# EAGLE design ttl_box (EAGLE 8.3.1)
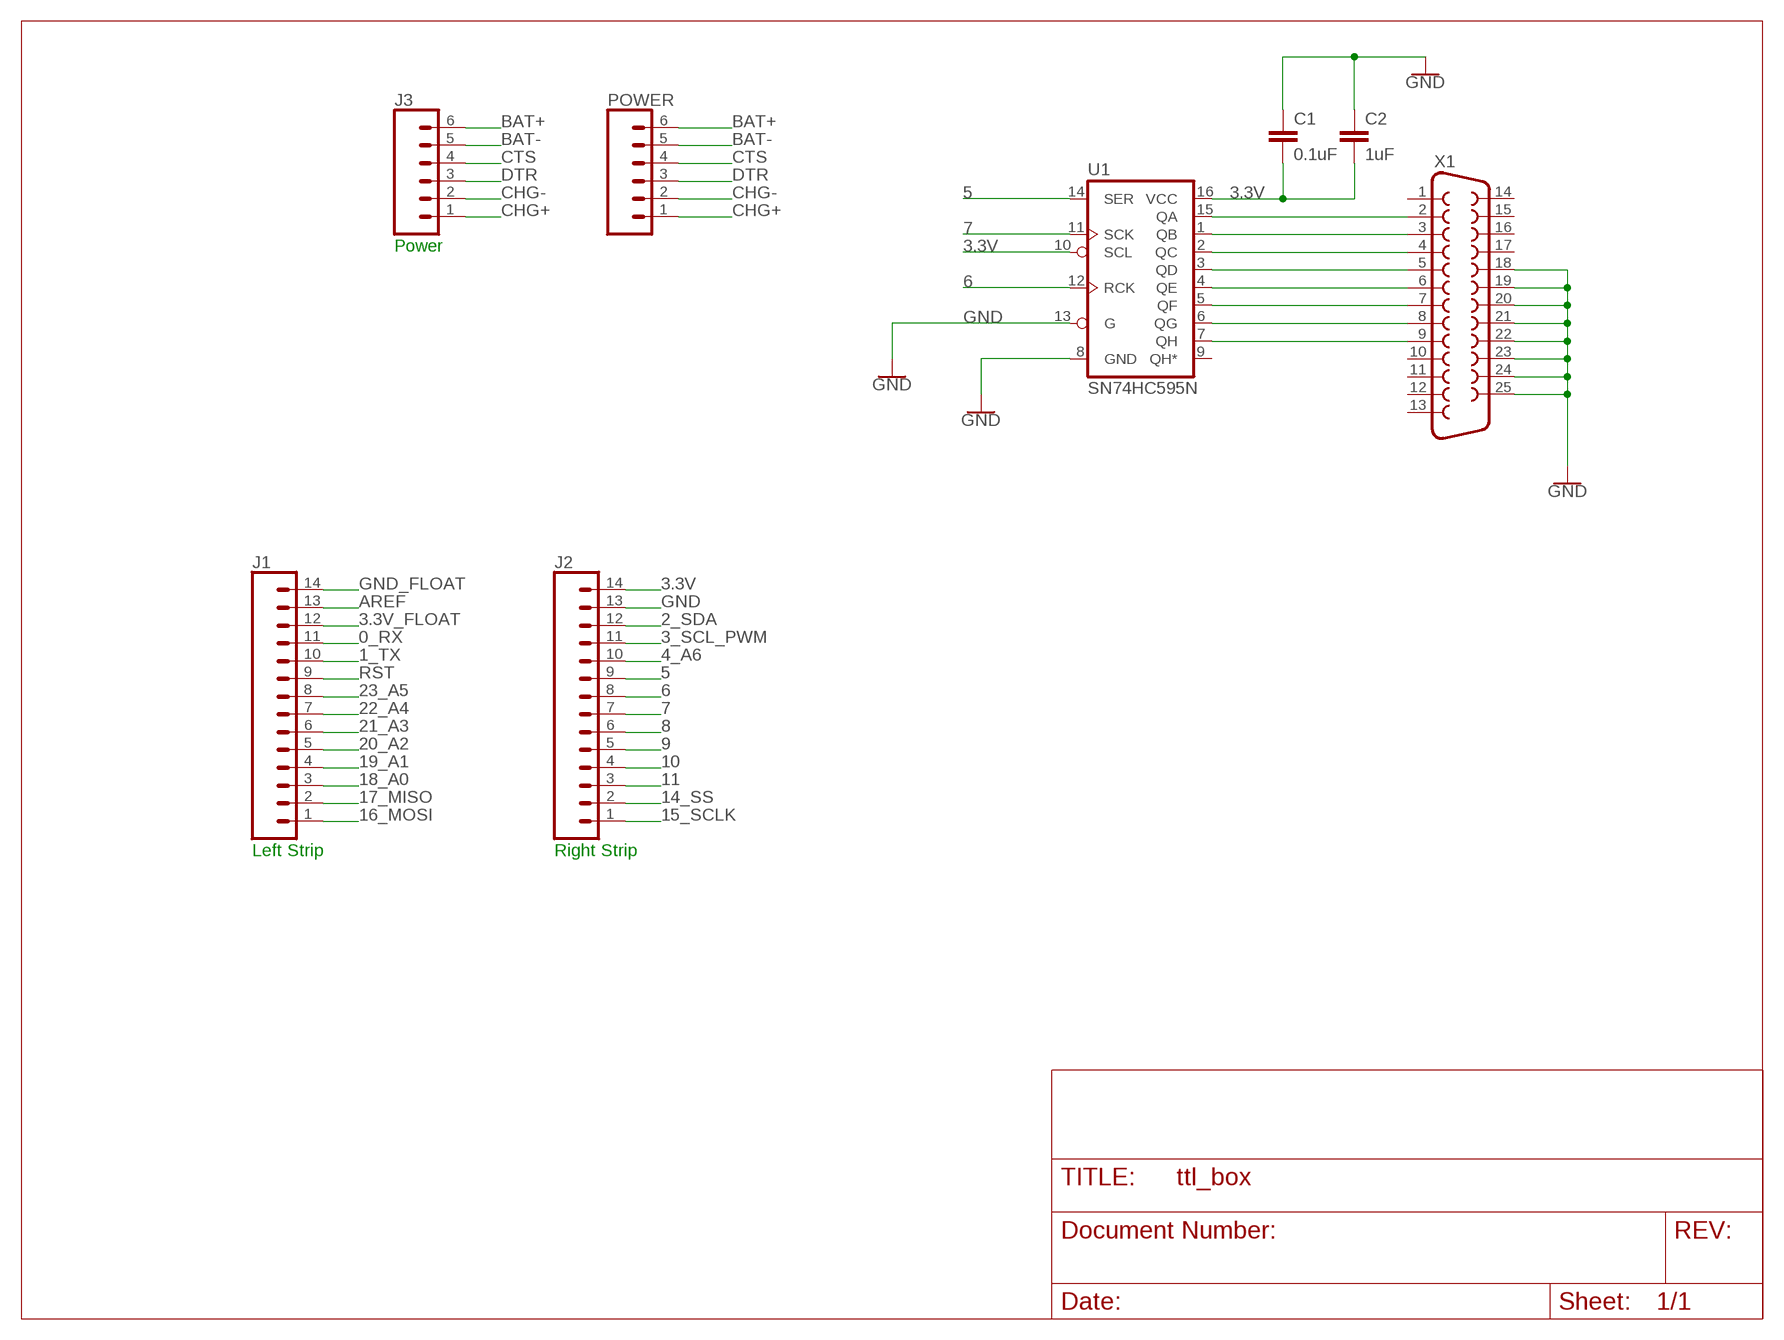
[diagram p0: schematic, sheet 1]

## Parts
C1  0.1uF  0.1UF-KIT-EZ-50V-20%  [CAP-PTH-SMALL-KIT]
C2  1uF  0.1UF-KIT-EZ-50V-20%  [CAP-PTH-SMALL-KIT]
J1  CONN_14  [1X14]
J2  CONN_14  [1X14]
J3  CONN_06SILK_FEMALE_PTH  [1X06]
POWER  CONN_06SILK_FEMALE_PTH  [1X06]
U1  SN74HC595N  74HC595N  [DIP16]
X1  DB25_FEMALEVB  [F25VB]

## Nets
0_RX: J1.11
1_TX: J1.10
2_SDA: J2.12
3.3V: C1.2 C2.2 J2.14 U1.10(SCL) U1.16(VCC)
3.3V_FLOAT: J1.12
3_SCL_PWM: J2.11
4_A6: J2.10
5: J2.9 U1.14(SER)
6: J2.8 U1.12(RCK)
7: J2.7 U1.11(SCK)
8: J2.6
9: J2.5
10: J2.4
11: J2.3
14_SS: J2.2
15_SCLK: J2.1
16_MOSI: J1.1
17_MISO: J1.2
18_A0: J1.3
19_A1: J1.4
20_A2: J1.5
21_A3: J1.6
22_A4: J1.7
23_A5: J1.8
AREF: J1.13
BAT+: J3.6 POWER.6
BAT-: J3.5 POWER.5
CHG+: J3.1 POWER.1
CHG-: J3.2 POWER.2
CTS: J3.4 POWER.4
DTR: J3.3 POWER.3
GND: C1.1 C2.1 J2.13 U1.8(GND) U1.13(G) X1.18 X1.19 X1.20 X1.21 X1.22 X1.23 X1.24 X1.25
GND_FLOAT: J1.14
N$1: U1.15(QA) X1.2
N$2: U1.1(QB) X1.3
N$3: U1.2(QC) X1.4
N$4: U1.3(QD) X1.5
N$5: U1.4(QE) X1.6
N$7: U1.5(QF) X1.7
N$8: U1.6(QG) X1.8
N$9: U1.7(QH) X1.9
RST: J1.9
Unconnected: U1.9(QH*) X1.1 X1.10 X1.11 X1.12 X1.13 X1.14 X1.15 X1.16 X1.17

## Notes on the sheet
- Power
- Left Strip | Right Strip

## Library data of the parts
C1 = SparkFun-Capacitors:0.1UF: 0.1µF ceramic capacitors A capacitor is a passive two-terminal electrical component used to store electrical energy temporarily in an electric field.; PROD_ID: CAP-08370
C2 = SparkFun-Capacitors:0.1UF: 0.1µF ceramic capacitors A capacitor is a passive two-terminal electrical component used to store electrical energy temporarily in an electric field.; PROD_ID: CAP-08370; VALUE: 0.1uF
J1 J2 = SparkFun-Connectors:CONN_14: Multi connection point. Often used as Generic Header-pin footprint for 0.1 inch spaced/style header connections On any of the 0.1 inch spaced packages, you can populate with these: Break Away Headers - Straight <https://www.sparkfun.com/products/116> (PRT-00116) Break Away Male Headers - Right Angle <https://www.sparkfun.com/products/553> (PRT-00553) Female Headers <https://www.sparkfun.com/products/115> (PRT-00115) Break Away Headers - Machine Pin <https://www.sparkfun.com/products/117> (PRT-00117) Break Away Female Headers - Swiss Machine Pin <https://www.sparkfun.com/products/743> (PRT-00743) For SCREWTERMINALS and SPRING TERMINALS visit here: Screw Terimnals on SparkFun.com <https://www.sparkfun.com/search/results?term=Screw+Terminals> (5mm/3.5mm/2.54mm spacing) This device is also useful as a general connection point to wire up your design to another part of your project. Our various solder wires solder well into these plated through hole pads. Hook-Up Wire - Assortment (Stranded, 22 AWG) <https://www.sparkfun.com/products/11375> (PRT-11375) Hook-Up Wire - Assortment (Solid Core, 22 AWG) <https://www.sparkfun.com/products/11367> (PRT-11367) View the entire wire category on our website here <https://www.sparkfun.com/categories/141> Special notes: Molex polarized connector foot print use with SKU : PRT-08231 with associated crimp pins and housings. 1MM SMD Version SKU: PRT-10208 NOTES ON THE VARIANTS LOCK and LOCK_LONGPADS... This footprint was designed to help hold the alignment of a through-hole component (i.e. 6-pin header) while soldering it into place. You may notice that each hole has been shifted either up or down by 0.005 of an inch from it's more standard position (which is a perfectly straight line). This slight alteration caused the pins (the squares in the middle) to touch the edges of the holes. Because they are alternating, it causes a "brace" to hold the component in place. 0.005 has proven to be the perfect amount of "off-center" position when using our standard breakaway headers. Although looks a little odd when you look at the bare footprint, once you have a header in there, the alteration is very hard to notice. Also,if you push a header all the way into place, it is covered up entirely on the bottom side.
J3 POWER = SparkFun-Connectors:CONN_06: Multi connection point. Often used as Generic Header-pin footprint for 0.1 inch spaced/style header connections On any of the 0.1 inch spaced packages, you can populate with these: Break Away Headers - Straight <https://www.sparkfun.com/products/116> (PRT-00116) Break Away Male Headers - Right Angle <https://www.sparkfun.com/products/553> (PRT-00553) Female Headers <https://www.sparkfun.com/products/115> (PRT-00115) Break Away Headers - Machine Pin <https://www.sparkfun.com/products/117> (PRT-00117) Break Away Female Headers - Swiss Machine Pin <https://www.sparkfun.com/products/743> (PRT-00743) Arduino Stackable Header - 6 Pin <https://www.sparkfun.com/products/9280> (PRT-09280) For SCREWTERMINALS and SPRING TERMINALS visit here: Screw Terimnals on SparkFun.com <https://www.sparkfun.com/search/results?term=Screw+Terminals> (5mm/3.5mm/2.54mm spacing) This device is also useful as a general connection point to wire up your design to another part of your project. Our various solder wires solder well into these plated through hole pads. Hook-Up Wire - Assortment (Stranded, 22 AWG) <https://www.sparkfun.com/products/11375> (PRT-11375) Hook-Up Wire - Assortment (Solid Core, 22 AWG) <https://www.sparkfun.com/products/11367> (PRT-11367) View the entire wire category on our website here <https://www.sparkfun.com/categories/141>; PROD_ID: CONN-08437
U1 = SparkFun-IC-Logic:74*595: 8-Bit Shift Register (Serial to Parallel) Datasheet <http://cdn.sparkfun.com/datasheets/BreakoutBoards/MM74HC595.pdf> SparkFun Products SparkFun Shift Register Breakout - 74HC595 <https://www.sparkfun.com/products/10680> (BOB-10680); PROD_ID: IC-13123
X1 = SparkFun-Retired:DB25_FEMALE: 25 Pin male connector. PCB edge mount for regular PCB thicknesses. This connector will connect directly to the back of a PC parallel port or through a normal DB25 extension cable (M/F). SKU: PRT-08287

## Board
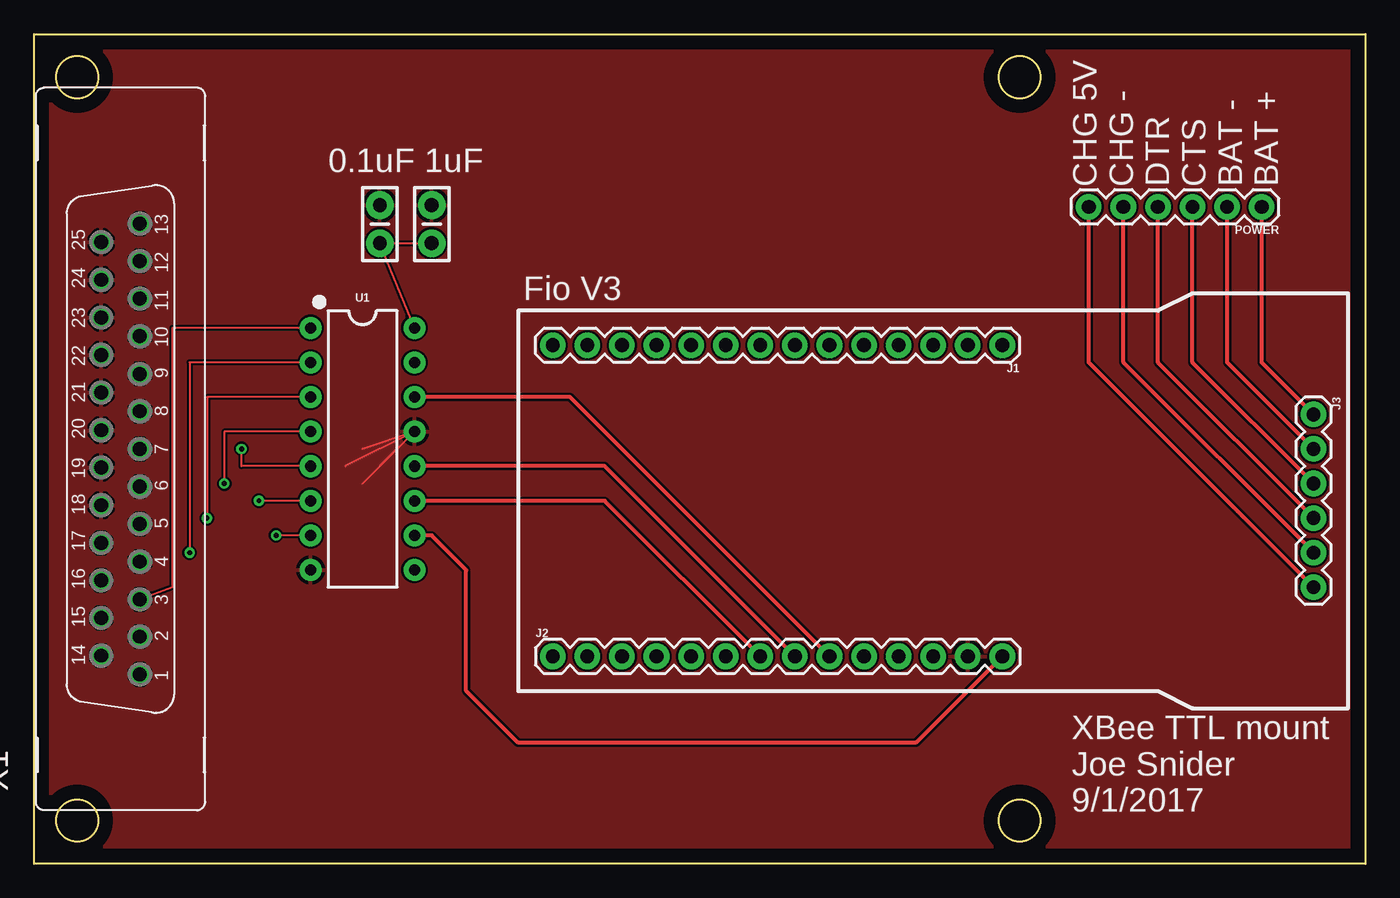
[diagram p1: board, top side]
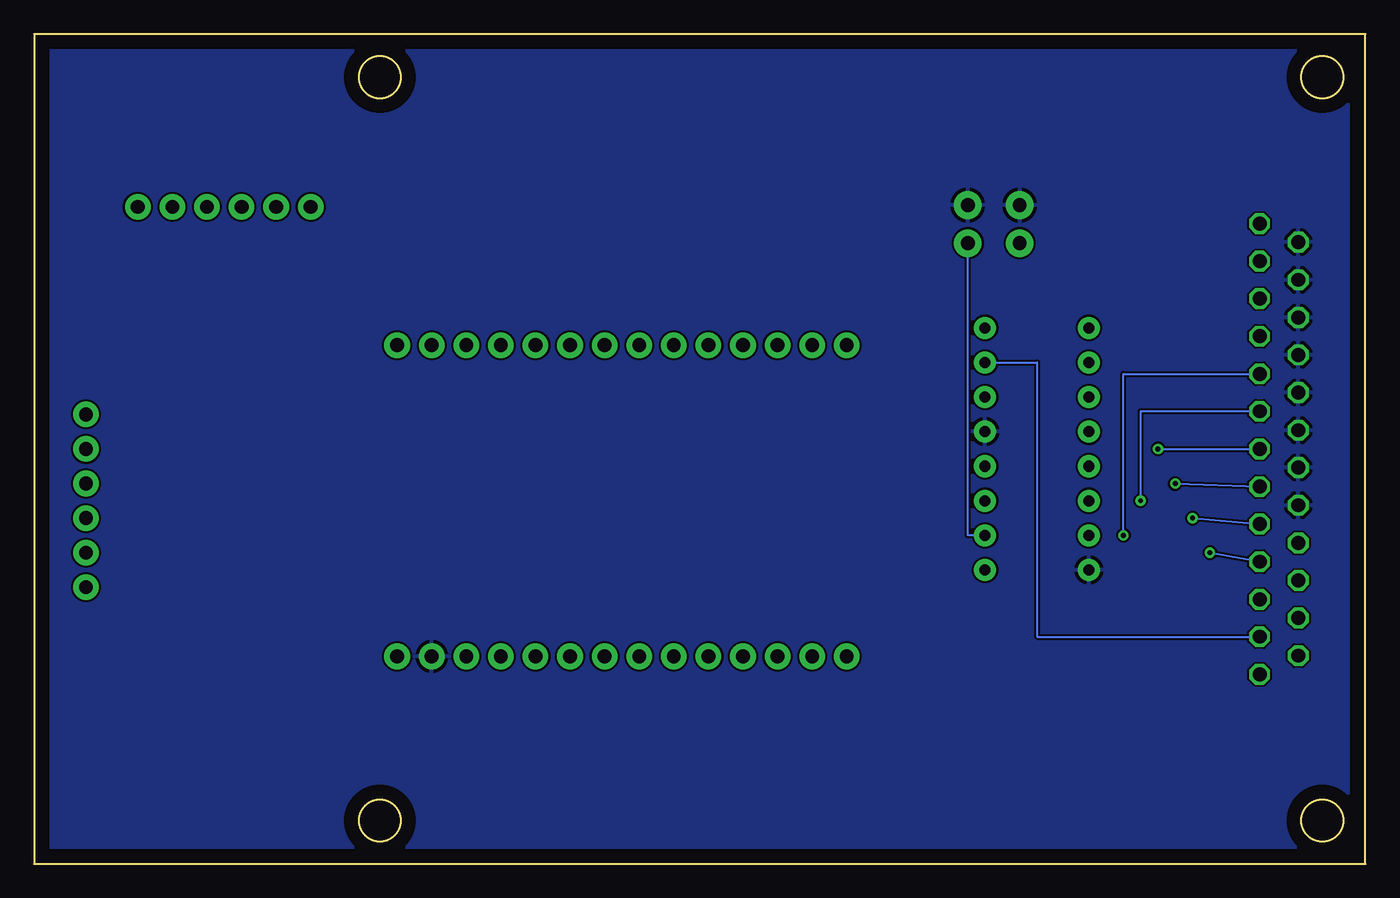
[diagram p2: board, bottom side, seen from below]

Size 97.79 x 60.96 mm. Coordinates in mm from the lower left corner, seen from the top.
Outline: 0,60.96 97.79,60.96 97.79,0 0,0 0,60.96
Outline: circle at 72.39,57.78 radius 1.52
Outline: circle at 72.39,3.17 radius 1.52
Outline: circle at 3.18,3.17 radius 1.52
Outline: circle at 3.18,57.78 radius 1.52
Copper layers (1*16): Top 0.035mm / dielectric 1.5mm / Bottom 0.035mm
Design rules "default": minimum track width 6mil, minimum drill 0.35mm, track to track 6mil, track to pad 6mil, pad to pad 6mil, via to via 6mil, smd to smd 6mil, copper to edge 40mil, drill to drill 6mil, minimum pad ring 10mil, minimum via ring 8mil, stop-mask expansion 4mil, vias tented up to drill 0mil, thermal gap 10mil

### Footprints (pad centres in the part's own frame; a part is rotated, then mirrored left to right if it is on the bottom)
CAP-PTH-SMALL-KIT = drill 1.016 pad 2.032: 1 -1.397,0; 2 1.397,0
1X14 = drill 1.016 pad 1.88: 1 0,0; 2 2.54,0; 3 5.08,0; 4 7.62,0; 5 10.16,0; 6 12.7,0; 7 15.24,0; 8 17.78,0; 9 20.32,0; 10 22.86,0; 11 25.4,0; 12 27.94,0; 13 30.48,0; 14 33.02,0
1X06 = drill 1.016 pad 1.88: 1 0,0; 2 2.54,0; 3 5.08,0; 4 7.62,0; 5 10.16,0; 6 12.7,0
DIP16 = drill 0.813 pad 1.626: 1 -8.89,-3.81; 2 -6.35,-3.81; 3 -3.81,-3.81; 4 -1.27,-3.81; 5 1.27,-3.81; 6 3.81,-3.81; 7 6.35,-3.81; 8 8.89,-3.81; 9 8.89,3.81; 10 6.35,3.81; 11 3.81,3.81; 12 1.27,3.81; 13 -1.27,3.81; 14 -3.81,3.81; 15 -6.35,3.81; 16 -8.89,3.81
F25VB = drill 1.016 octagon: 1 -16.561,-1.422; 2 -13.792,-1.422; 3 -11.049,-1.422; 4 -8.28,-1.422; 5 -5.512,-1.422; 6 -2.769,-1.422; 7 0,-1.422; 8 2.769,-1.422; 9 5.512,-1.422; 10 8.28,-1.422; 11 11.049,-1.422; 12 13.792,-1.422; 13 16.561,-1.422; 14 -15.189,1.422; 15 -12.421,1.422; 16 -9.652,1.422; 17 -6.909,1.422; 18 -4.14,1.422; 19 -1.372,1.422; 20 1.372,1.422; 21 4.14,1.422; 22 6.909,1.422; 23 9.652,1.422; 24 12.421,1.422; 25 15.189,1.422

### Placement (x,y rotation side)
C1  25.4,46.99 270 top
C2  29.21,46.99 270 top
J1  71.12,38.1 180 top
J2  38.1,15.24 0 top
J3  93.98,33.02 270 top
POWER  90.17,48.26 180 top
U1  24.13,30.48 270 top
X1  6.35,30.48 90 top

### Tracks (layer width: path | path; a pad name or v marks a point on that pad's centre or on a via)
3.3V
  Top 0.152: U1.16 C1.2 C2.2
  Top 0.305: J2.14 64.77,8.89 35.56,8.89 31.75,12.7 31.75,21.59 29.21,24.13 U1.10
  Bottom 0.152: U1.10 29.21,24.13 C2.2
5
  Top 0.305: J2.9 39.37,34.29 U1.14
6
  Top 0.305: J2.8 41.91,29.21 U1.12
7
  Top 0.305: J2.7 41.91,26.67 U1.11
BAT+
  Top 0.305: J3.6 77.47,36.83 POWER.6
BAT-
  Top 0.305: J3.5 80.01,36.83 POWER.5
CHG+
  Top 0.305: J3.1 90.17,36.83 POWER.1
CHG-
  Top 0.305: J3.2 87.63,36.83 POWER.2
CTS
  Top 0.305: J3.4 82.55,36.83 POWER.4
DTR
  Top 0.305: J3.3 85.09,36.83 POWER.3
GND
  Top 0.152: 25.4,29.21 U1.13 | U1.13 24.13,27.94 | U1.13 24.13,30.48 | U1.13 22.86,29.21
  pour Top: 0,60.96 97.79,60.96 97.79,0 0,0
  pour Bottom: 0,60.96 97.79,60.96 97.79,0 0,0
N$1
  Bottom 0.152: U1.15 24.13,36.83 24.13,16.69 X1.2
N$2
  Top 0.152: U1.1 10.16,39.37 10.16,20.32 X1.3
N$3  (via drill 0.35)
  Top 0.152: U1.2 11.43,36.83 v11.43,22.86
  Bottom 0.152: v11.43,22.86 X1.4
N$4  (via drill 0.35)
  Top 0.152: U1.3 12.7,34.29 v12.7,25.4
  Bottom 0.152: v12.7,25.4 X1.5
N$5  (via drill 0.35)
  Top 0.152: U1.4 13.97,31.75 v13.97,27.94
  Bottom 0.152: v13.97,27.94 X1.6
N$7  (via drill 0.35)
  Top 0.152: U1.5 15.24,29.21 v15.24,30.48
  Bottom 0.152: v15.24,30.48 X1.7
N$8  (via drill 0.35)
  Top 0.152: U1.6 v16.51,26.67
  Bottom 0.152: v16.51,26.67 16.51,33.25 X1.8
N$9  (via drill 0.35)
  Top 0.152: U1.7 v17.78,24.13
  Bottom 0.152: v17.78,24.13 17.78,35.99 X1.9

### Text on the board
tPlace: 0.1uF 1uF | CHG 5V / CHG - / DTR / CTS / BAT - / BAT + | Fio V3 | XBee TTL mount / Joe Snider / 9/1/2017